# EAGLE design ble2mqtt (EAGLE 9.2.2)
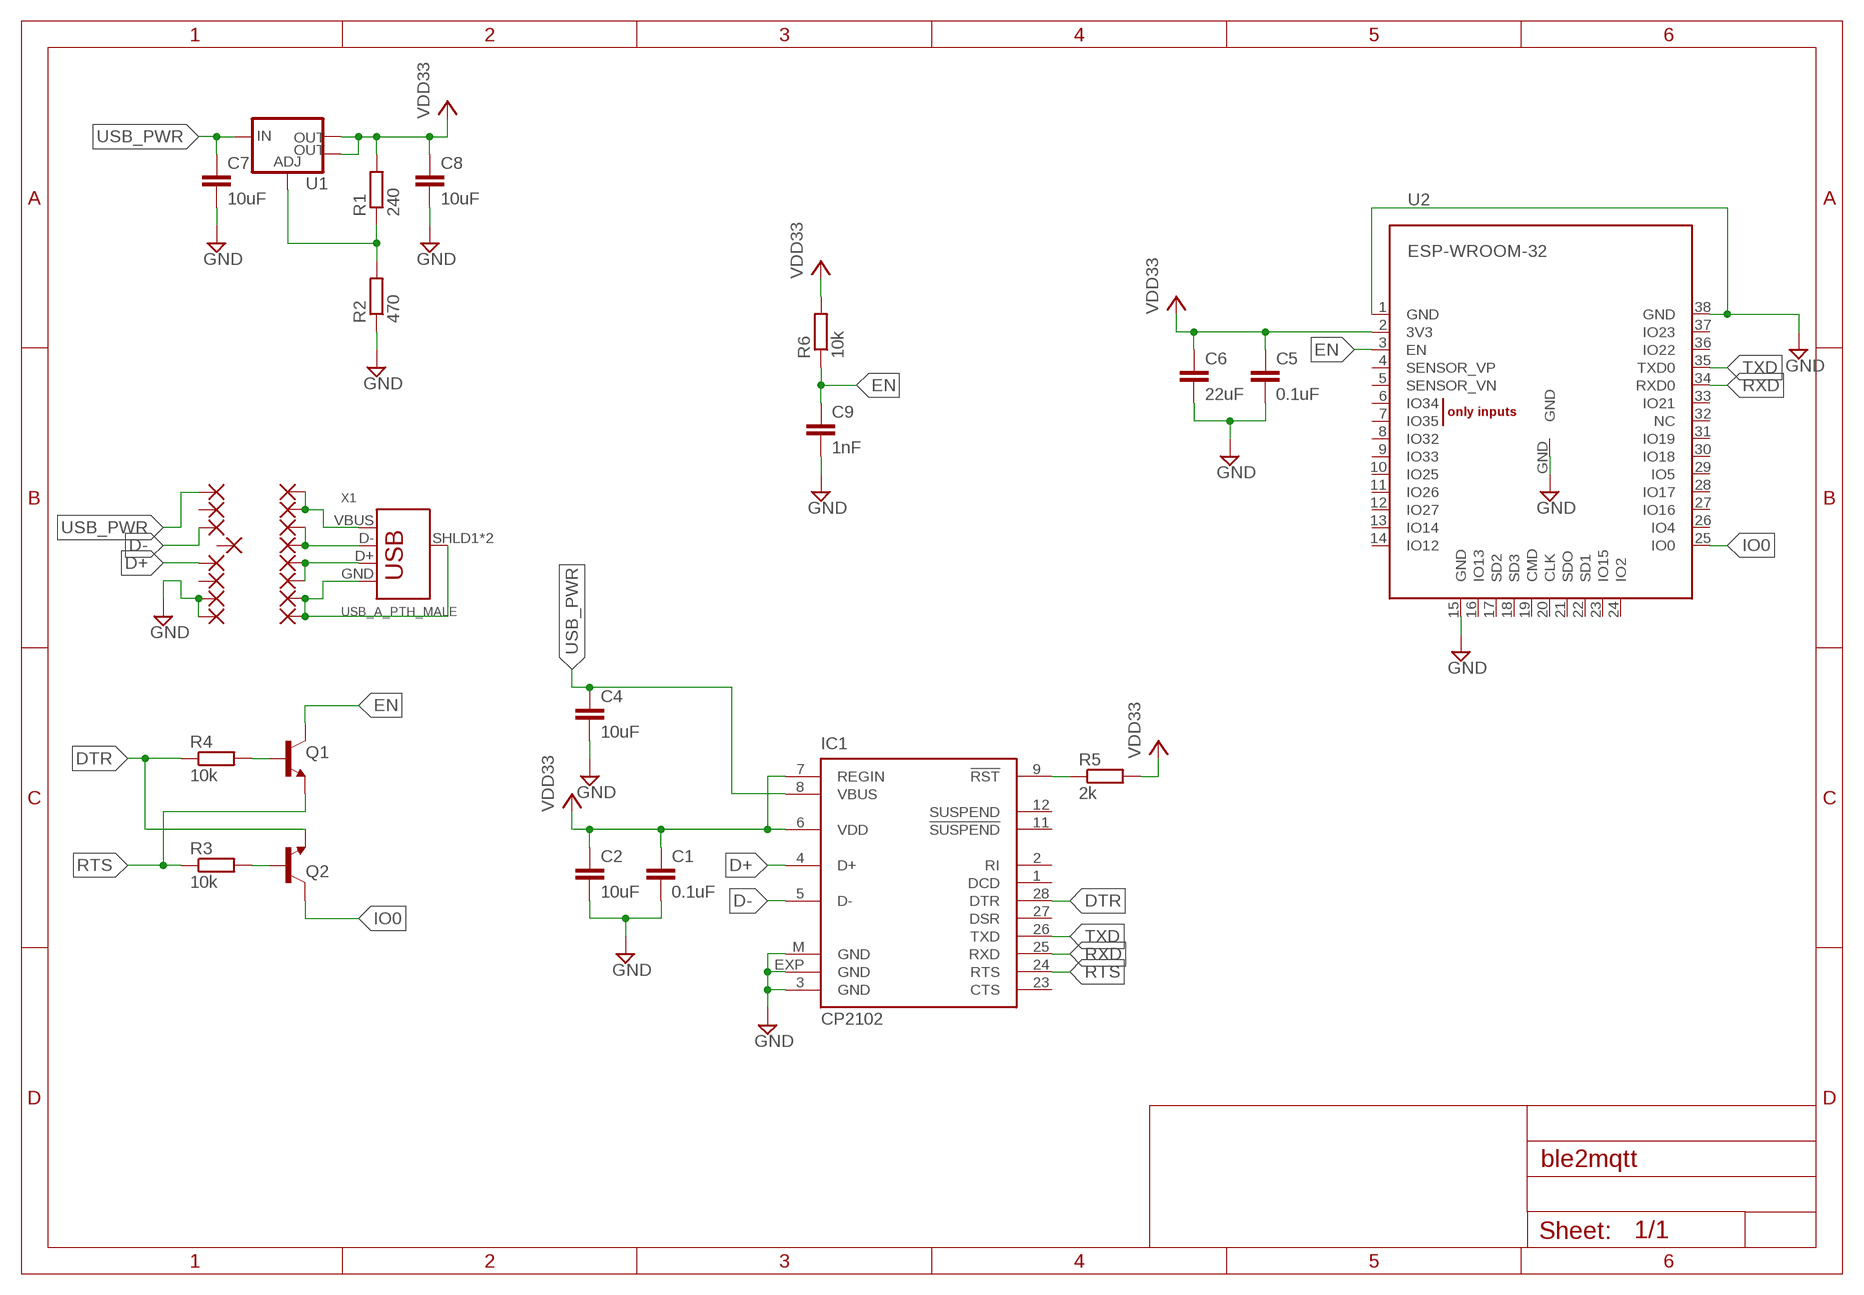
[diagram p0: schematic, sheet 1]

## Parts
C1  0.1uF  CAPACITOR_0402  [0402]
C2  10uF  CAPACITOR_0402  [0402]
C4  10uF  CAPACITOR_0402  [0402]
C5  0.1uF  CAPACITOR_0402  [0402]
C6  22uF  CAPACITOR_0402  [0402]
C7  10uF  CAPACITOR_0402  [0402]
C8  10uF  CAPACITOR_0402  [0402]
C9  1nF  CAPACITOR_0402  [0402]
IC1  CP2102  [MLP28]
PAD1  WIREPADSMD1,27-254  [SMD1,27-2,54]
PAD2  WIREPADSMD1,27-254  [SMD1,27-2,54]
PAD3  WIREPADSMD1,27-254  [SMD1,27-2,54]
PAD4  WIREPADSMD1,27-254  [SMD1,27-2,54]
PAD5  WIREPADSMD1,27-254  [SMD1,27-2,54]
PAD6  WIREPADSMD1,27-254  [SMD1,27-2,54]
PAD7  WIREPADSMD1,27-254  [SMD1,27-2,54]
PAD8  WIREPADSMD1,27-254  [SMD1,27-2,54]
PAD9  WIREPADSMD1,27-254  [SMD1,27-2,54]
PAD10  WIREPADSMD1,27-254  [SMD1,27-2,54]
PAD11  WIREPADSMD1,27-254  [SMD1,27-2,54]
PAD12  WIREPADSMD1,27-254  [SMD1,27-2,54]
PAD13  WIREPADSMD1,27-254  [SMD1,27-2,54]
PAD14  WIREPADSMD1,27-254  [SMD1,27-2,54]
PAD15  WIREPADSMD1,27-254  [SMD1,27-2,54]
PAD16  WIREPADSMD1,27-254  [SMD1,27-2,54]
Q1  TRANS_NPN-MMBT2222AL  [SOT23-3]
Q2  TRANS_NPN-MMBT2222AL  [SOT23-3]
R1  240  RESISTOR_0402  [0402]
R2  470  RESISTOR_0402  [0402]
R3  10k  RESISTOR_0402  [0402]
R4  10k  RESISTOR_0402  [0402]
R5  2k  RESISTOR_0402  [0402]
R6  10k  RESISTOR_0402  [0402]
U1  V_REG_LM1117SOT223  [SOT223]
U2  ESP-WROOM-32  [ESP-WROOM-32]
X1  USB_A_PTH_MALE  [USB-A-H]

## Nets
D+: IC1.4(D+) PAD13.1(P)
D-: IC1.5(D-) PAD11.1(P)
DTR: IC1.28(DTR) Q2.2(E) R4.1
EN: C9.1 Q1.3(C) R6.1 U2.3(EN)
GND: C1.2 C2.2 C4.2 C5.2 C6.2 C7.2 C8.2 C9.2 IC1.3(GND) IC1.EXP(GND) IC1.M(GND) PAD15.1(P) PAD16.1(P) R2.1 U2.1(GND) U2.15(GND) U2.38(GND) U2.GND
GND2: PAD7.1(P) PAD8.1(P) X1.GND X1.SHLD1(SHIELD) X1.SHLD2(SHIELD)
IO0: Q2.3(C) U2.25(IO0)
N$1: IC1.9(!RST) R5.1
N$2: Q2.1(B) R3.2
N$3: PAD1.1(P) PAD2.1(P) X1.VBUS
N$4: PAD3.1(P) PAD4.1(P) X1.D-
N$5: Q1.1(B) R4.2
N$7: PAD5.1(P) PAD6.1(P) X1.D+
N$13: R1.1 R2.2 U1.1(ADJ)
RTS: IC1.24(RTS) Q1.2(E) R3.1
RXD: IC1.25(RXD) U2.34(RXD0)
TXD: IC1.26(TXD) U2.35(TXD0)
USB_PWR: C4.1 C7.1 IC1.8(VBUS) PAD9.1(P) U1.3(IN)
VCC: C1.1 C2.1 C5.1 C6.1 C8.1 IC1.6(VDD) IC1.7(REGIN) R1.2 R5.2 R6.2 U1.2(OUT) U1.4(OUT) U2.2(3V3) ; supply symbol labelled VDD33
Unconnected: IC1.1(DCD) IC1.2(RI) IC1.11(!SUSPEND) IC1.12(SUSPEND) IC1.23(CTS) IC1.27(DSR) PAD10.1(P) PAD12.1(P) PAD14.1(P) U2.4(SENSOR_VP) U2.5(SENSOR_VN) U2.6(IO34) U2.7(IO35) U2.8(IO32) U2.9(IO33) U2.10(IO25) U2.11(IO26) U2.12(IO27) U2.13(IO14) U2.14(IO12) U2.16(IO13) U2.17(SD2) U2.18(SD3) U2.19(CMD) U2.20(CLK) U2.21(SDO) U2.22(SD1) U2.23(IO15) U2.24(IO2) U2.26(IO4) U2.27(IO16) U2.28(IO17) U2.29(IO5) U2.30(IO18) U2.31(IO19) U2.32(NC) U2.33(IO21) U2.36(IO22) U2.37(IO23)

## Library data of the parts
C1 C2 C4-C9 = mine:CAPACITOR
IC1 = silabs:CP210*: Single-Chip USB to UART Bridge Source: www.silabs.com .. CP2101.pdf / cp2102.pdf; MF: FARNELL; MPN: CP2102-GM; OC_FARNELL: 9282130; OC_NEWARK: 30K5635
PAD1-PAD16 = wirepad:WIREPAD: Wire PAD connect wire on PCB
Q1 Q2 = SparkFun-DiscreteSemi:TRANS_NPN: NPN transistor Current controlled devices typically used to amplify current or used as a switch. BC547 - COM-08928 <http://www.sparkfun.com/products/8928> (TO-92 45V 100mA) (1.Collector 2.Base 3.Emitter) 2N3904 - COM-00521 <http://www.sparkfun.com/products/521> (TO-92 40V 200mA) (1.Emitter 2.Base 3.Collector) P2N2222A - COM-12852 <http://www.sparkfun.com/products/12852> (TO-92 40V 600mA) (1.Collector 2.Base 3.Emitter); PROD_ID: TRANS-08049; VALUE: 600mA/40V
R1-R6 = mine:RESISTOR
U1 = SparkFun-IC-Power:V_REG_LM1117: Voltage Regulator LM1117 Standard adjustable voltage regulator but in SMD form. Spark Fun Electronics SKU : COM-00595; PROD_ID: VREG-08170
U2 = esp32:ESP-WROOM-32
X1 = SparkFun-Connectors:USB_A: USB-A Connector Male and female variants, as well as PTH and SMT variants SparkFun Products: SparkFun XBee Explorer Dongle <https://www.sparkfun.com/products/11697> PTH Male SparkFun MicroView-USB Programmer <https://www.sparkfun.com/products/12924> SMT Male SparkFun USB Type A Female Breakout <https://www.sparkfun.com/products/12700> SMT Female; PROD_ID: CONN-08367; SF_ID: PRT-00437

## Board
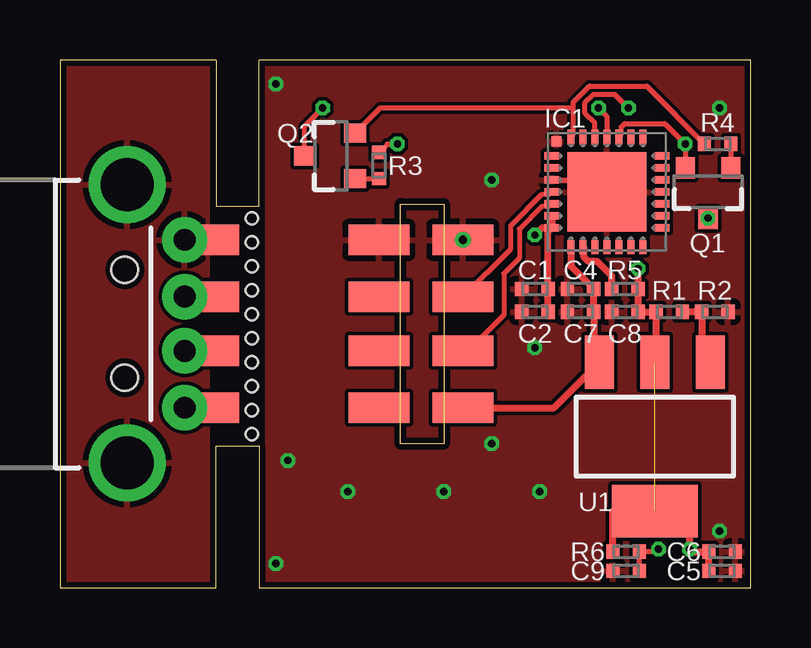
[diagram p1: board, top side]
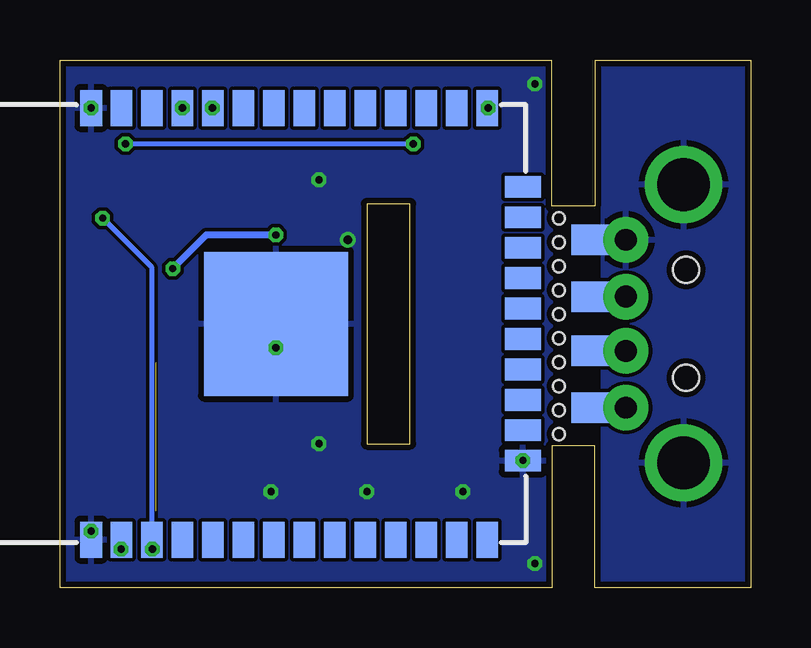
[diagram p2: board, bottom side, seen from below]

Size 28.8 x 22 mm. Coordinates in mm from the lower left corner, seen from the top.
Outline: 0,0 6.5,0 6.5,5.9 8.3,5.9 8.3,0 28.8,0 28.8,22 8.3,22 8.3,15.9 6.5,15.9 6.5,22 0,22 0,0
Outline: 14.2,16 16,16 16,6 14.2,6 14.2,16
Copper layers (1*16): Top 0.035mm / dielectric 1.5mm / Bottom 0.035mm
Design rules "SeeedStudio_2layer_DRU_no_angle_20140221_fixed_drill_size": minimum track width 6mil, minimum drill 0.3mm, track to track 6mil, track to pad 6mil, pad to pad 6mil, via to via 6mil, smd to smd 0mil, copper to edge 10mil, drill to drill 10mil, minimum pad ring 10mil, minimum via ring 6mil, stop-mask expansion 2mil, vias tented up to drill 100mil, thermal gap 10mil
Holes 0.5 mm at 8,15.4 8,14.4 8,13.4 8,12.4 8,11.4 8,10.4 8,9.4 8,8.4 8,7.4 8,6.4

### Footprints (pad centres in the part's own frame; a part is rotated, then mirrored left to right if it is on the bottom)
0402 = smd 0.55 x 0.6: 1 -0.55,0; 2 0.55,0
MLP28 = smd 0.6 x 0.3: 1 -2.3,1.5; 2 -2.3,1; 3 -2.3,0.5; 4 -2.3,0; 5 -2.3,-0.5; 6 -2.3,-1; 7 -2.3,-1.5; 15 2.3,-1.5; 16 2.3,-1; 17 2.3,-0.5; 18 2.3,0; 19 2.3,0.5; 20 2.3,1; 21 2.3,1.5 | smd 0.3 x 0.6: 8 -1.5,-2.3; 9 -1,-2.3; 10 -0.5,-2.3; 11 0,-2.3; 12 0.5,-2.3; 13 1,-2.3; 14 1.5,-2.3; 22 1.5,2.3; 23 1,2.3; 24 0.5,2.3; 25 0,2.3; 26 -0.5,2.3; 27 -1,2.3; 28 -1.5,2.3 | smd 3.3 x 3.3: EXP 0,0 | smd 0.435 x 0.435: M -2.103,2.103
SMD1,27-2,54 = smd 1.27 x 2.54: 1 0,0
SOT23-3 = smd 0.8 x 0.9: 1 -0.95,-1; 2 0.95,-1; 3 0,1.1
SOT223 = smd 1.219 x 2.235: 1 -2.311,-3.099; 2 0,-3.099; 3 2.311,-3.099 | smd 3.6 x 2.2: 4 0,3.099
ESP-WROOM-32 = smd 0.9 x 1.5: 1 7.7,9; 2 6.43,9; 3 5.16,9; 4 3.89,9; 5 2.62,9; 6 1.35,9; 7 0.08,9; 8 -1.19,9; 9 -2.46,9; 10 -3.73,9; 11 -5,9; 12 -6.27,9; 13 -7.54,9; 14 -8.81,9; 25 -8.81,-9; 26 -7.54,-9; 27 -6.27,-9; 28 -5,-9; 29 -3.73,-9; 30 -2.46,-9; 31 -1.19,-9; 32 0.08,-9; 33 1.35,-9; 34 2.62,-9; 35 3.89,-9; 36 5.16,-9; 37 6.43,-9; 38 7.7,-9 | smd 1.5 x 0.9: 15 -10.3,5.715; 16 -10.3,4.445; 17 -10.3,3.175; 18 -10.3,1.905; 19 -10.3,0.635; 20 -10.3,-0.635; 21 -10.3,-1.905; 22 -10.3,-3.175; 23 -10.3,-4.445; 24 -10.3,-5.715 | smd 6 x 6: GND 0,0
USB-A-H = drill 0.914 pad 1.88: D+ 2.4,1.127; D- 2.4,-1.127; GND 2.4,3.5; VBUS 2.4,-3.5 | drill 2.2: SHLD1 0,-5.8; SHLD2 0,5.8 | hole 1.1: -0.1,2.25; -0.1,-2.25

### Placement (x,y rotation side)
C1  19.8,12.45 180 top
C2  19.8,11.5 180 top
C4  21.7,12.45 180 top
C5  27.6,0.7 0 top
C6  27.6,1.5 0 top
C7  21.7,11.5 180 top
C8  23.55,11.5 180 top
C9  23.6,0.7 180 top
IC1  22.8,16.5 0 top
PAD1  6.2,7.5 90 top
PAD2  6.2,7.5 270 bottom
PAD3  6.2,9.87 90 top
PAD4  6.2,9.87 90 bottom
PAD5  6.2,12.13 90 top
PAD6  6.2,12.13 90 bottom
PAD7  6.2,14.5 270 top
PAD8  6.2,14.5 90 bottom
PAD9  16.8,7.5 90 top
PAD10  13.3,7.5 90 top
PAD11  16.8,9.87 90 top
PAD12  13.3,9.87 90 top
PAD13  16.8,12.13 90 top
PAD14  13.3,12.13 90 top
PAD15  16.8,14.5 90 top
PAD16  13.3,14.5 90 top
Q1  27.02,16.5 180 top
Q2  11.3,18 90 top
R1  25.4,11.5 180 top
R2  27.3,11.5 180 top
R3  13.3,17.6 270 top
R4  27.42,18.5 0 top
R5  23.55,12.45 0 top
R6  23.6,1.5 180 top
U1  24.8,6.29 180 top
U2  19.8,11 180 bottom
X1  2.8,11 0 top

### Tracks (layer width: path | path; a pad name or v marks a point on that pad's centre or on a via)
D+
  Top 0.2: PAD13.1 18.8,14.12 18.8,15.1 20.09,16.4 20.4,16.4 IC1.4
D-
  Top 0.2: IC1.5 20.4,15.9 20.09,15.9 19.15,14.96 19.15,13.75 18.5,13.1 18.5,11.37 17,9.87 PAD11.1
DTR
  Top 0.2: IC1.28 21.4,18.9 21.4,20 | 21.4,20 21.4,20.23 22.07,20.91 24.46,20.91 R4.1 | 21.4,20 13.35,20 Q2.2
EN  (via drill 0.3)
  Top 0.2: C9.1 R6.1 24.85,1.5 v24.95,1.6
  Bottom 0.2: v24.95,1.6 U2.3 24.96,13.34 Q1.3
  other vias: 27.02,15.4
GND  (via drill 0.3, 0.35)
  Top 0.2: IC1.3 22.3,17 IC1.EXP
  other vias: 16.8,14.5 9.5,5.3 27.5,20 27.5,2.35 19.8,10 12,4 16,4 20,4 18,6 18,17 9,21 9,1
  pour Bottom: 28.8,22 28.8,0 8.3,0 8.3,22
  pour Top: 8.6,22 8.6,0 28.8,0 28.8,22
GND2
  Top 0.5: X1.GND PAD7.1
  pour Bottom: 0,22 6.2,22 6.2,0 0,0
  pour Top: 0,22 6.2,22 6.2,0 0,0
IO0  (via drill 0.3)
  Top 0.2: Q2.3 10.2,19.25 v10.95,20
  Bottom 0.3: v10.95,20 U2.25
N$1
  Top 0.3: R5.1 23,13 22.4,13.6 22.02,13.6 21.85,13.78 21.85,14.15 IC1.9
N$2
  Top 0.2: Q2.1 R3.2
N$3
  Top 0.5: X1.VBUS PAD1.1
  Bottom 0.5: PAD1.1 X1.VBUS
N$4
  Top 0.5: X1.D- PAD4.1
  Bottom 0.5: PAD4.1 X1.D-
N$5
  Top 0.2: R4.2 Q1.1
N$7
  Top 0.5: X1.D+ PAD5.1
  Bottom 0.5: PAD5.1 X1.D+
N$13
  Top 0.3: R1.1 R2.2 26.75,9.75 U1.1
RTS  (via drill 0.3)
  Top 0.2: Q1.2 v26.07,18.5 25.22,19.35 23.55,19.35 23.4,19.2 23.4,18.9 IC1.24 | R3.1 13.65,18.5 v14.07,18.5
  Bottom 0.2: v14.07,18.5 v26.07,18.5
RXD  (via drill 0.3)
  Top 0.2: v22.45,20 22.8,19.65 IC1.25
  Bottom 0.3: v22.45,20 U2.34 | U2.34
TXD  (via drill 0.3)
  Top 0.2: IC1.26 22.3,19.36 21.89,19.77 21.89,20.23 22.22,20.55 23.14,20.55 v23.7,20
  Bottom 0.3: v23.7,20 U2.35 | U2.35
USB_PWR
  Top 0.3: PAD9.1 20.6,7.5 U1.3 22.25,9.63 C7.1 C4.1 21.3,13.4 IC1.8
VCC  (via drill 0.3)  (1 unrouted)
  Top 0.3: C5.1 C6.1 26.35,1.5 v26.25,1.6 26.25,3.19 U1.4 23.05,3.19 R6.2 23.11,1.5 | IC1.6 IC1.7 | U1.2 24.85,9.44 R1.2 C8.1 R5.2 v24.1,13.3 | IC1.7 20.1,15 v19.8,14.7 | C2.1 C1.1 20.35,14.85 IC1.7
  Bottom 0.3: U2.2 26.25,1.98 v26.25,1.6 | v19.8,14.7 22.7,14.7 v24.1,13.3